# Altium project PCB_Project1.PrjPcb
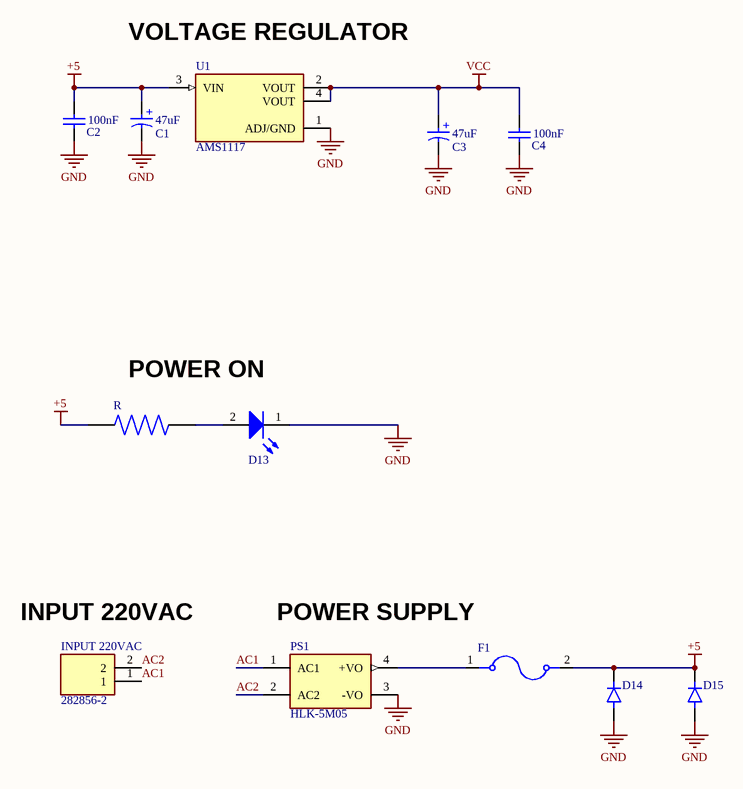
[diagram p0: input.SchDoc]
3 sheets, 71 parts. Net scope: global (net labels, ports and power ports of the same name join across sheets).
Board file: PCB1.PcbDoc
Sheets:
  input.SchDoc
  output.SchDoc
  control.SchDoc

## Sheet input.SchDoc
size A; SheetNumber: 1; SheetTotal: 3

### Parts
C1  47uF  [WCAP-ASLI_D6.3H7.7]
C2  100nF  [WCAP-CSGP_0603_L1.6W0.8H0.8_Wave]
C3  47uF  [WCAP-ASLI_D6.3H7.7]
C4  100nF  [WCAP-CSGP_0603_L1.6W0.8H0.8_Wave]
D13  Infrared, 1.4V, 140°  [WL-SICW_0805_L2W1.3H0.8]  (value not drawn)
D14  S1G  [DIO_S1G]  (value not drawn)
D15  S1G  [DIO_S1G]  (value not drawn)
F1  0154004.DR  [FUSE_0154004.DR]  (value not drawn)
INPUT_220VAC  282856-2  [TE_282856-2]
PS1  HLK-5M05  [CONV_HLK-5M05]
R  FCR1206J10R  [RESC3216X70N]  (value not drawn)
U1  AMS1117  [SOT229P700X180-4N]

### Nets
+5: C1.1(P) C2.2 D14.1(K) D15.1(K) F1.2 R.1 U1.3(VIN)
GND: C1.2(N) C2.1 C3.2(N) C4.1 D13.1(K) D14.2(A) D15.2(A) PS1.3(-VO) U1.1(ADJ/GND)
VCC: C3.1(P) C4.2 U1.2(VOUT) U1.4(VOUT)
AC1: INPUT_220VAC.1 PS1.1(AC1)
AC2: INPUT_220VAC.2 PS1.2(AC2)
NetD13_2: D13.2(A) R.2
NetF1_1: F1.1 PS1.4(+VO)

### Notes on the sheet
- (near U1) VOLTAGE REGULATOR
- POWER ON
- (near INPUT_220VAC) INPUT 220VAC
- (near PS1) POWER SUPPLY
- (in symbol 865080443007) +

### Library data of the parts
C1 C3 = 865080443007: WCAP-ASLI Aluminum Electrolytic Capacitor, V-Chip, D6.3 x H5.5mm, 47uF, 25V; Manufacturer: Wurth Elektronik; Capacitance Tolerance: +/-20%; Dissipation Factor: 14%; Endurance: 2000h; Leakage Current: 11.75uA; Ripple Current: 220mA; Technical Reference: ASED055470M025DVCTBB000; Manufacturer Part Number: 865080443007; Category: Aluminum Electrolytic Capacitors; Match Code: WCAP-ASLI; ComponentLink1Description: Website Link; ComponentLink1URL: https://www.we-online.com/redexpert/article/865080443007?ad; ComponentLink2Description: Datasheet Link; ComponentLink2URL: https://www.we-online.com/redexpert/spec/865080443007?ad; Mount: Surface Mount; Operating Temperature Max: 105°C; Operating Temperature Min: -55°C; Packaging: Tape and Reel; Height: 5.5mm; Diameter: 6.3mm; Capacitance: 47uF; Rated Voltage (DC): 25V
C2 C4 = 885012206071: WCAP-CSGP Multilayer Ceramic Chip Capacitor, General Purpose, size 0603, X7R, 100nF, 25VDC; Manufacturer: Wurth Elektronik; Case/Size Code: 0603; Capacitance Tolerance: +/-10%; Dissipation Factor: 3.5%; Insulation Resistance: 5GΩ; Rated Voltage (DC): 25V; Technical Reference: X7R0603104K025DFCT10000; Manufacturer Part Number: 885012206071; Category: Multilayer Ceramic Chip Capacitors; Match Code: WCAP-CSGP; ComponentLink1Description: Website Link; ComponentLink1URL: https://www.we-online.com/redexpert/article/885012206071?ad; ComponentLink2Description: Datasheet Link; ComponentLink2URL: https://www.we-online.com/redexpert/spec/885012206071?ad; Mount: Surface Mount; Operating Temperature Max: 125°C; Operating Temperature Min: -55°C; Packaging: Tape and Reel; Length: 1.6mm; Width: 0.8mm; Height: 0.8mm; Capacitance: 100nF; Ceramic Type: X7R
D13 = 15412085BA400: WL-SICW SMT Chip LED Infrared Waterclear, size 1206, Infrared, 1.4V, 140°; Manufacturer: Wurth Elektronik; Case/Size Code: 1206; Centroid Wavelength: 850nm; Chip Technology: AlGaAs; Forward Voltage Max: 2V; Radiant Intensity: 2.5mW/sr; Radiant Intensity Min: 1mW/sr; Manufacturer Part Number: 15412085BA400; Category: Infrared LEDs; Match Code: WL-SICW; ComponentLink1Description: Website Link; ComponentLink1URL: https://www.we-online.com/redexpert/article/15412085BA400?ad; ComponentLink2Description: Datasheet Link; ComponentLink2URL: https://www.we-online.com/redexpert/spec/15412085BA400?ad; Mount: Surface Mount; Operating Temperature Max: 85°C; Operating Temperature Min: -40°C; Packaging: Tape and Reel; Length: 3.2mm; Width: 1.6mm; Height: 1.1mm; Emitting Color: Infrared; Forward Voltage: 1.4V; Peak Wavelength: 850nm; Viewing Angle: 140°
D14 D15 = S1G: Diode Standard 400 V 1A Surface Mount DO-214AC (SMA); MF: ON Semiconductor; SnapEDA_Link: https://www.snapeda.com/parts/S1G/Onsemi/view-part/?ref=snap; Value: *; MP: S1G; Availability: In Stock; Purchase-URL: https://pricing.snapeda.com/search/part/S1G/?ref=eda; Check_prices: https://www.snapeda.com/parts/S1G/Onsemi/view-part/?ref=eda; Package: SMA Taiwan Semiconductor; Price: None
F1 = 0154004.DR: 154/154T/154L/154TL Series OMNI-BLOKÂ® Fuse and Holder Assembly; Package: None; Availability: Unavailable; Value: *; MP: 0154004.DR; Price: None
INPUT_220VAC = 282856-2: TERMI-BLOK PCB MOUNT 2P; MF: TE Connectivity; Purchase-URL: https://pricing.snapeda.com/search/part/282856-2/?ref=eda; Package: None; MP: 282856-2; EU_RoHS_Compliance: Compliant with Exemptions; Price: None; Availability: In Stock; Value: *; Check_prices: https://www.snapeda.com/parts/282856-2/TE+Connectivity+AMP+Connectors/view-part/?ref=eda; SnapEDA_Link: https://www.snapeda.com/parts/282856-2/TE+Connectivity+AMP+Connectors/view-part/?ref=snap
PS1 = HLK-5M05: AC DC 220V to 5V 5W 5Watt Isolated Switching Step-Down Power Supply Module Converter; MF: Hi-link; Check_prices: https://www.snapeda.com/parts/HLK-5M05/Hi-link/view-part/?ref=eda; SnapEDA_Link: https://www.snapeda.com/parts/HLK-5M05/Hi-link/view-part/?ref=snap; Price: None; Availability: Not in stock; Package: Package; MP: HLK-5M05; Value: *
R = FCR1206J10R: Res 1206 10 Ohm 5% 1/8W Â±500ppm/Â°C Molded SMD SMD T/R; Resistance: 10; Power_Rating: .125 W; MF: TE Connectivity; DigiKey-Purchase-URL: https://snapeda.com/shop?store=DigiKey&id=988597; Package: 1206; EU_RoHS_Compliance: Compliant with Exemptions; Tolerance: 5%; Value: *; MP: FCR1206J10R; Price: None; SnapEDA_Link: https://www.snapeda.com/parts/FCR1206J10R/TE%20Connectivity%20Passive%20Product/view-part/988597/?ref=snap; Mouser-Purchase-URL: https://snapeda.com/shop?store=Mouser&id=988597; Availability: Warning
U1 = AMS1117: 1A LOW DROPOUT VOLTAGE REGULATOR SOT-223; MF: Advanced Monolithic Systems; Price: None; Availability: Not in stock; Package: SOT-223 Seeed Technology; MP: AMS1117; Value: *; SnapEDA_Link: https://www.snapeda.com/parts/AMS1117/Advanced+Monolithic+Systems/view-part/?ref=snap; Check_prices: https://www.snapeda.com/parts/AMS1117/Advanced+Monolithic+Systems/view-part/?ref=eda

## Sheet output.SchDoc
size A; SheetNumber: 2; SheetTotal: 3
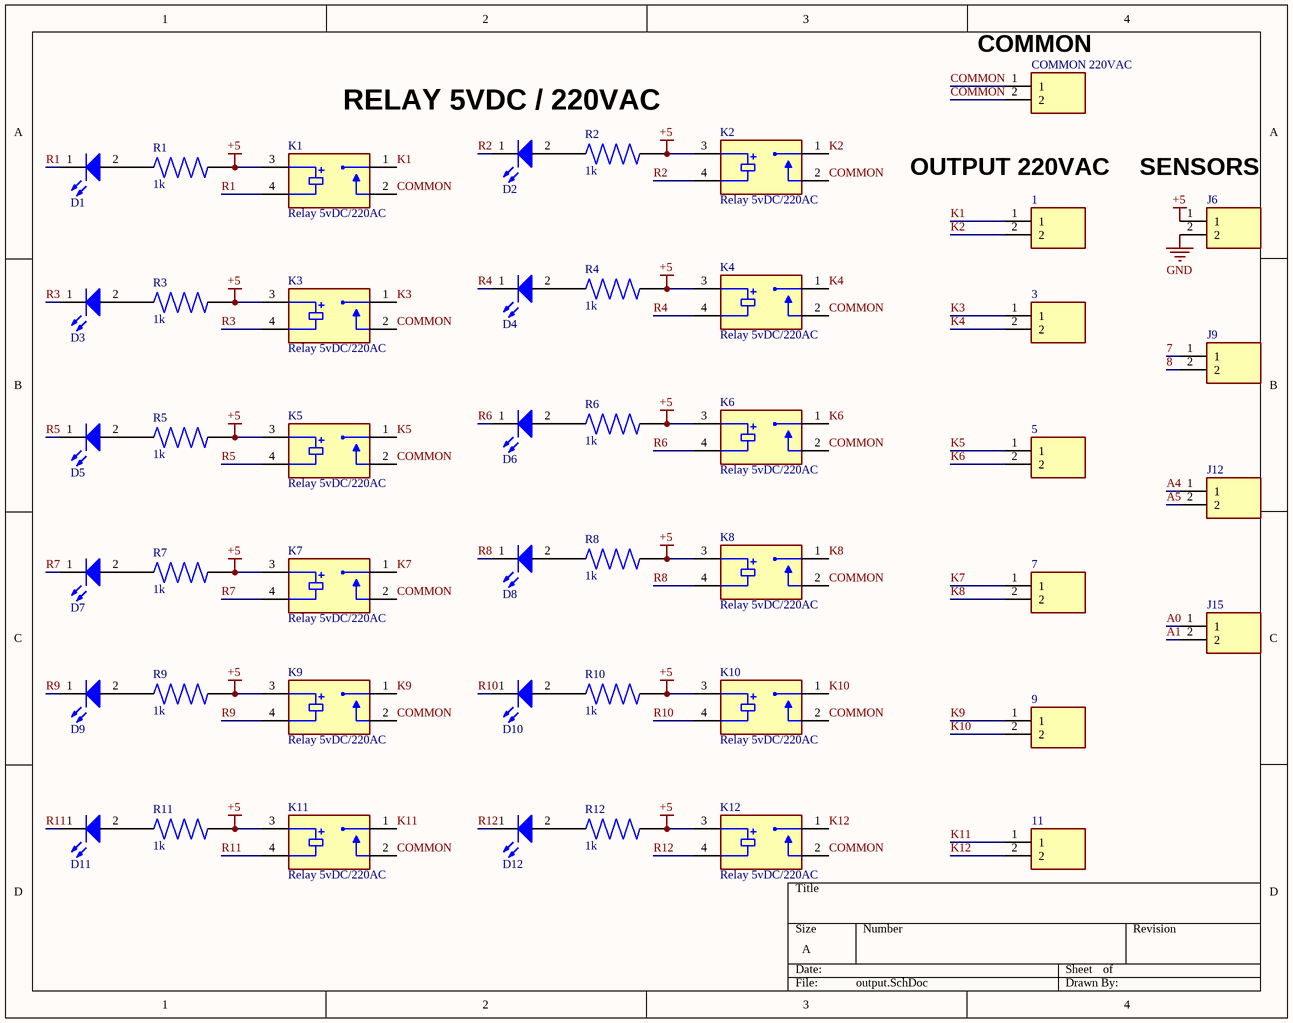
[diagram p1: output.SchDoc]

### Parts
1  282856-2  [TE_282856-2]  (value not drawn)
3  282856-2  [TE_282856-2]  (value not drawn)
5  282856-2  [TE_282856-2]  (value not drawn)
7  282856-2  [TE_282856-2]  (value not drawn)
9  282856-2  [TE_282856-2]  (value not drawn)
11  282856-2  [TE_282856-2]  (value not drawn)
COMMON_220VAC  282856-2  [TE_282856-2]  (value not drawn)
D1  Infrared, 1.4V, 140°  [WL-SICW_0805_L2W1.3H0.8]  (value not drawn)
D2  Infrared, 1.4V, 140°  [WL-SICW_0805_L2W1.3H0.8]  (value not drawn)
D3  Infrared, 1.4V, 140°  [WL-SICW_0805_L2W1.3H0.8]  (value not drawn)
D4  Infrared, 1.4V, 140°  [WL-SICW_0805_L2W1.3H0.8]  (value not drawn)
D5  Infrared, 1.4V, 140°  [WL-SICW_0805_L2W1.3H0.8]  (value not drawn)
D6  Infrared, 1.4V, 140°  [WL-SICW_0805_L2W1.3H0.8]  (value not drawn)
D7  Infrared, 1.4V, 140°  [WL-SICW_0805_L2W1.3H0.8]  (value not drawn)
D8  Infrared, 1.4V, 140°  [WL-SICW_0805_L2W1.3H0.8]  (value not drawn)
D9  Infrared, 1.4V, 140°  [WL-SICW_0805_L2W1.3H0.8]  (value not drawn)
D10  Infrared, 1.4V, 140°  [WL-SICW_0805_L2W1.3H0.8]  (value not drawn)
D11  Infrared, 1.4V, 140°  [WL-SICW_0805_L2W1.3H0.8]  (value not drawn)
D12  Infrared, 1.4V, 140°  [WL-SICW_0805_L2W1.3H0.8]  (value not drawn)
J6  282856-2  [TE_282856-2]  (value not drawn)
J9  282856-2  [TE_282856-2]  (value not drawn)
J12  282856-2  [TE_282856-2]  (value not drawn)
J15  282856-2  [TE_282856-2]  (value not drawn)
K1  Relay 5vDC/220AC  [RELAY_G3MB-202PDC5]
K2  Relay 5vDC/220AC  [RELAY_G3MB-202PDC5]
K3  Relay 5vDC/220AC  [RELAY_G3MB-202PDC5]
K4  Relay 5vDC/220AC  [RELAY_G3MB-202PDC5]
K5  Relay 5vDC/220AC  [RELAY_G3MB-202PDC5]
K6  Relay 5vDC/220AC  [RELAY_G3MB-202PDC5]
K7  Relay 5vDC/220AC  [RELAY_G3MB-202PDC5]
K8  Relay 5vDC/220AC  [RELAY_G3MB-202PDC5]
K9  Relay 5vDC/220AC  [RELAY_G3MB-202PDC5]
K10  Relay 5vDC/220AC  [RELAY_G3MB-202PDC5]
K11  Relay 5vDC/220AC  [RELAY_G3MB-202PDC5]
K12  Relay 5vDC/220AC  [RELAY_G3MB-202PDC5]
R1  1k  [RESC3216X70N]
R2  1k  [RESC3216X70N]
R3  1k  [RESC3216X70N]
R4  1k  [RESC3216X70N]
R5  1k  [RESC3216X70N]
R6  1k  [RESC3216X70N]
R7  1k  [RESC3216X70N]
R8  1k  [RESC3216X70N]
R9  1k  [RESC3216X70N]
R10  1k  [RESC3216X70N]
R11  1k  [RESC3216X70N]
R12  1k  [RESC3216X70N]

### Nets
+5: J6.1 K1.3 K2.3 K3.3 K4.3 K5.3 K6.3 K7.3 K8.3 K9.3 K10.3 K11.3 K12.3 R1.2 R2.2 R3.2 R4.2 R5.2 R6.2 R7.2 R8.2 R9.2 R10.2 R11.2 R12.2
GND: J6.2
7: J9.1
8: J9.2
A0: J15.1
A1: J15.2
A4: J12.1
A5: J12.2
COMMON: COMMON_220VAC.1 COMMON_220VAC.2 K1.2 K2.2 K3.2 K4.2 K5.2 K6.2 K7.2 K8.2 K9.2 K10.2 K11.2 K12.2
K1: 1.1 K1.1
K2: 1.2 K2.1
K3: 3.1 K3.1
K4: 3.2 K4.1
K5: 5.1 K5.1
K6: 5.2 K6.1
K7: 7.1 K7.1
K8: 7.2 K8.1
K9: 9.1 K9.1
K10: 9.2 K10.1
K11: 11.1 K11.1
K12: 11.2 K12.1
R1: D1.1(K) K1.4
R2: D2.1(K) K2.4
R3: D3.1(K) K3.4
R4: D4.1(K) K4.4
R5: D5.1(K) K5.4
R6: D6.1(K) K6.4
R7: D7.1(K) K7.4
R8: D8.1(K) K8.4
R9: D9.1(K) K9.4
R10: D10.1(K) K10.4
R11: D11.1(K) K11.4
R12: D12.1(K) K12.4
NetD1_2: D1.2(A) R1.1
NetD2_2: D2.2(A) R2.1
NetD3_2: D3.2(A) R3.1
NetD4_2: D4.2(A) R4.1
NetD5_2: D5.2(A) R5.1
NetD6_2: D6.2(A) R6.1
NetD7_2: D7.2(A) R7.1
NetD8_2: D8.2(A) R8.1
NetD9_2: D9.2(A) R9.1
NetD10_2: D10.2(A) R10.1
NetD11_2: D11.2(A) R11.1
NetD12_2: D12.2(A) R12.1

### Notes on the sheet
- RELAY 5VDC / 220VAC
- (near COMMON_220VAC) COMMON
- OUTPUT 220VAC
- (near J6) SENSORS

### Library data of the parts
1 3 5 7 9 11 COMMON_220VAC J6 J9 J12 J15 = 282856-2: as INPUT_220VAC on sheet input; Purchase-URL: https://pricing.snapeda.com/search/part/282856-2/?ref=eda; Package: None; MP: 282856-2; EU_RoHS_Compliance: Compliant with Exemptions; Price: None; Availability: In Stock; Value: *; Check_prices: https://www.snapeda.com/parts/282856-2/TE+Connectivity+AMP+Connectors/view-part/?ref=eda; SnapEDA_Link: https://www.snapeda.com/parts/282856-2/TE+Connectivity+AMP+Connectors/view-part/?ref=snap
D1-D12 = 15412085BA400: as D13 on sheet input; Manufacturer Part Number: 15412085BA400; Category: Infrared LEDs; Match Code: WL-SICW; ComponentLink1Description: Website Link; ComponentLink1URL: https://www.we-online.com/redexpert/article/15412085BA400?ad; ComponentLink2Description: Datasheet Link; ComponentLink2URL: https://www.we-online.com/redexpert/spec/15412085BA400?ad; Mount: Surface Mount; Operating Temperature Max: 85°C; Operating Temperature Min: -40°C; Packaging: Tape and Reel; Length: 3.2mm; Width: 1.6mm; Height: 1.1mm; Emitting Color: Infrared; Forward Voltage: 1.4V; Peak Wavelength: 850nm; Viewing Angle: 140°
K1-K12 = G3MB-202PDC5: Solid State SPST-NO (1 Form A) 4-SIP; MF: Omron Automation; SnapEDA_Link: https://www.snapeda.com/parts/G3MB-202P%20DC5/Omron+Automation+and+Safety/view-part/?ref=snap; Value: *; MP: G3MB-202P DC5; Availability: Not in stock; Check_prices: https://www.snapeda.com/parts/G3MB-202P%20DC5/Omron+Automation+and+Safety/view-part/?ref=eda; Package: None; Price: None
R1-R12 = FCR1206J10R: as R on sheet input; DigiKey-Purchase-URL: https://snapeda.com/shop?store=DigiKey&id=988597; Package: 1206; EU_RoHS_Compliance: Compliant with Exemptions; Tolerance: 5%; Value: *; MP: FCR1206J10R; Price: None; SnapEDA_Link: https://www.snapeda.com/parts/FCR1206J10R/TE%20Connectivity%20Passive%20Product/view-part/988597/?ref=snap; Mouser-Purchase-URL: https://snapeda.com/shop?store=Mouser&id=988597; Availability: Warning

## Sheet control.SchDoc
size A; SheetNumber: 3; SheetTotal: 3
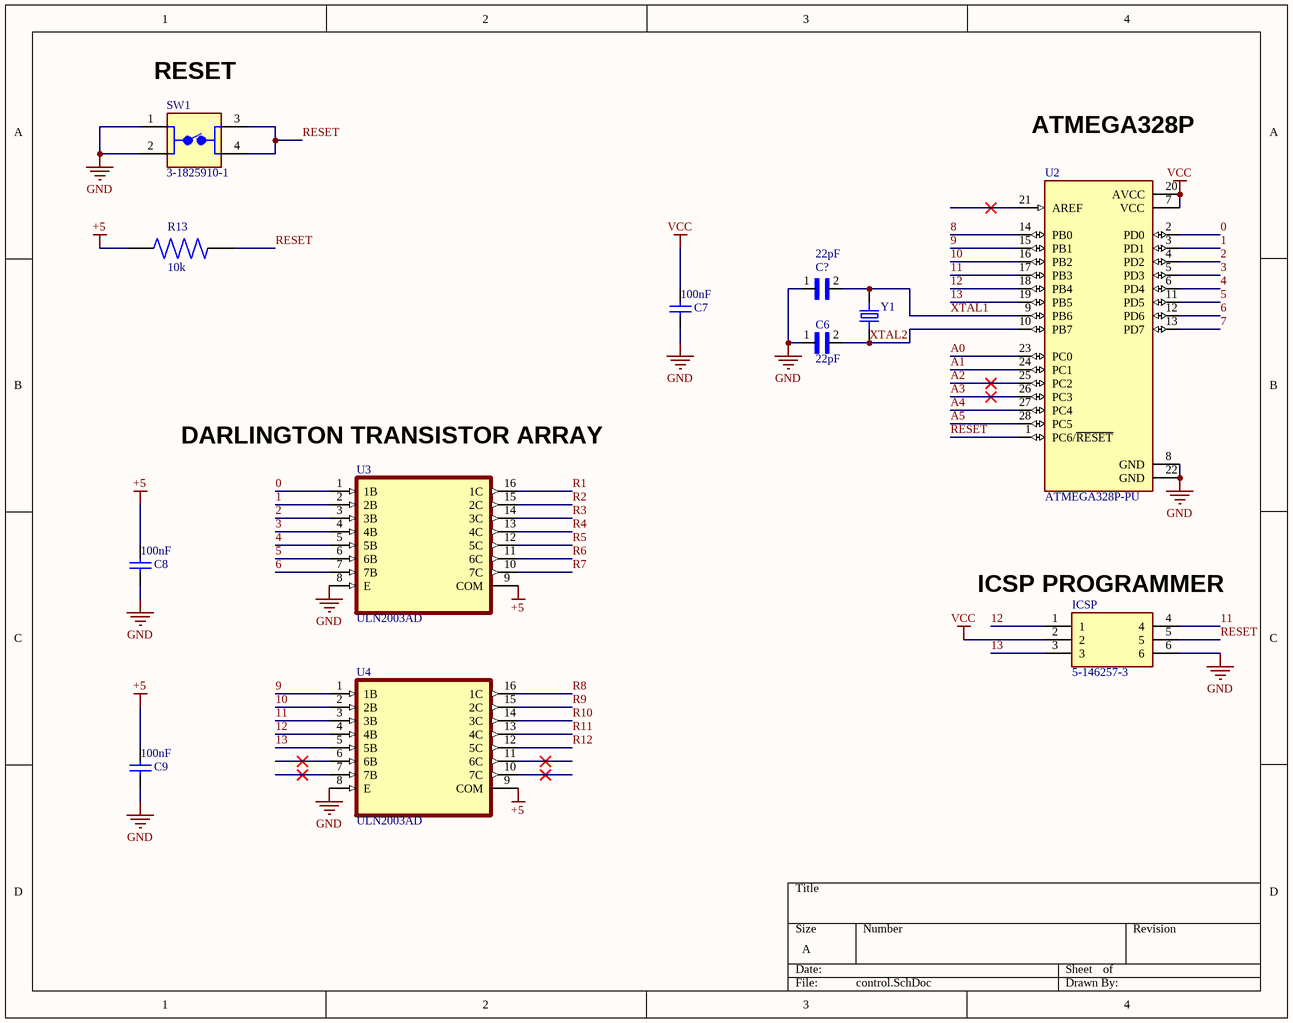
[diagram p2: control.SchDoc]

### Parts
C5  22pF  value C?  [CAPC2012X130N]
C6  22pF  [CAPC2012X130N]
C7  100nF  [WCAP-CSGP_0603_L1.6W0.8H0.8_Wave]
C8  100nF  [WCAP-CSGP_0603_L1.6W0.8H0.8_Wave]
C9  100nF  [WCAP-CSGP_0603_L1.6W0.8H0.8_Wave]
ICSP  5-146257-3  [TE_5-146257-3]
R13  10k  [RESC3216X70N]
SW1  3-1825910-1  [TE_3-1825910-1]
U2  ATMEGA328P-PU  [DIL28]
U3  ULN2003AD  [SOIC127P600X175-16N]
U4  ULN2003AD  [SOIC127P600X175-16N]
Y1  (no value)  [XTAL_ECS-160-20-3X-TR]

### Nets
+5: C8.2 C9.2 R13.1 U3.9(COM) U4.9(COM)
GND: C5.1 C6.1 C7.1 C8.1 C9.1 ICSP.6 SW1.1 SW1.2 U2.8(GND) U2.22(GND) U3.8(E) U4.8(E)
VCC: C7.2 ICSP.2 U2.7(VCC) U2.20(AVCC)
0: U2.2(PD0) U3.1(1B)
1: U2.3(PD1) U3.2(2B)
2: U2.4(PD2) U3.3(3B)
3: U2.5(PD3) U3.4(4B)
4: U2.6(PD4) U3.5(5B)
5: U2.11(PD5) U3.6(6B)
6: U2.12(PD6) U3.7(7B)
7: U2.13(PD7)
8: U2.14(PB0)
9: U2.15(PB1) U4.1(1B)
10: U2.16(PB2) U4.2(2B)
11: ICSP.4 U2.17(PB3) U4.3(3B)
12: ICSP.1 U2.18(PB4) U4.4(4B)
13: ICSP.3 U2.19(PB5) U4.5(5B)
A0: U2.23(PC0)
A1: U2.24(PC1)
A2: U2.25(PC2)
A3: U2.26(PC3)
A4: U2.27(PC4)
A5: U2.28(PC5)
R1: U3.16(1C)
R2: U3.15(2C)
R3: U3.14(3C)
R4: U3.13(4C)
R5: U3.12(5C)
R6: U3.11(6C)
R7: U3.10(7C)
R8: U4.16(1C)
R9: U4.15(2C)
R10: U4.14(3C)
R11: U4.13(4C)
R12: U4.12(5C)
RESET: ICSP.5 R13.2 SW1.3 SW1.4 U2.1(PC6/~{RESET})
XTAL1: C5.2 U2.9(PB6) Y1.2
XTAL2: C6.2 U2.10(PB7) Y1.1

Not connected (* = marked no-connect by the designer): U2 21(AREF)*; U4 6(6B)* 7(7B)* 10(7C)* 11(6C)*

### Notes on the sheet
- (near SW1) RESET
- ATMEGA328P
- (near U3) DARLINGTON TRANSISTOR ARRAY
- (near ICSP) ICSP PROGRAMMER

### Library data of the parts
C5 C6 = 0805Y0500220JCT: Cap Cer 22pf 50v C0g/Np0 0805; MF: Syfer; Mouser-Purchase-URL: https://snapeda.com/shop?store=Mouser&id=1818858; Package: 2012 Knowles Syfer; Price: None; MP: 0805Y0500220JCT; Availability: Warning; SnapEDA_Link: https://www.snapeda.com/parts/0805Y0500220JCT/Syfer/view-part/1818858/?ref=snap; BuyPart: https://www.snapeda.com/parts/0805Y0500220JCT/Syfer/view-part/1818858/?ref=eda
  C6: Value: *
C7-C9 = 885012206071: as C2 on sheet input; Manufacturer Part Number: 885012206071; Category: Multilayer Ceramic Chip Capacitors; Match Code: WCAP-CSGP; ComponentLink1Description: Website Link; ComponentLink1URL: https://www.we-online.com/redexpert/article/885012206071?ad; ComponentLink2Description: Datasheet Link; ComponentLink2URL: https://www.we-online.com/redexpert/spec/885012206071?ad; Mount: Surface Mount; Operating Temperature Max: 125°C; Operating Temperature Min: -55°C; Packaging: Tape and Reel; Length: 1.6mm; Width: 0.8mm; Height: 0.8mm; Capacitance: 100nF; Ceramic Type: X7R
ICSP = 5-146257-3: Header; Breakaway; 0.100 x 0.100 in.; PC Board; Dual; 6; 0.025 in.; 0.12 in.; MF: TE Connectivity; EU_RoHS_Compliance: Compliant; SnapEDA_Link: https://www.snapeda.com/parts/5-146257-3/TE+Connectivity+AMP+Connectors/view-part/?ref=snap; Purchase-URL: https://pricing.snapeda.com/search/part/5-146257-3/?ref=eda; Package: None; MP: 5-146257-3; Price: None; Availability: In Stock; Check_prices: https://www.snapeda.com/parts/5-146257-3/TE+Connectivity+AMP+Connectors/view-part/?ref=eda; Value: *
R13 = FCR1206J10R: as R on sheet input; DigiKey-Purchase-URL: https://snapeda.com/shop?store=DigiKey&id=988597; Package: 1206; EU_RoHS_Compliance: Compliant with Exemptions; Tolerance: 5%; Value: *; MP: FCR1206J10R; Price: None; SnapEDA_Link: https://www.snapeda.com/parts/FCR1206J10R/TE%20Connectivity%20Passive%20Product/view-part/988597/?ref=snap; Mouser-Purchase-URL: https://snapeda.com/shop?store=Mouser&id=988597; Availability: Warning
SW1 = 3-1825910-1: Switch Push Button OFF (ON) SPST Round Button 0.05A 24VDC Momentary Contact PC Pins Thru-Hole; MF: TE Connectivity; Value: *; SnapEDA_Link: https://www.snapeda.com/parts/3-1825910-1/TE+Connectivity+ALCOSWITCH+Switches/view-part/?ref=snap; Purchase-URL: https://pricing.snapeda.com/search/part/3-1825910-1/?ref=eda; Availability: In Stock; Price: None; Package: None; Check_prices: https://www.snapeda.com/parts/3-1825910-1/TE+Connectivity+ALCOSWITCH+Switches/view-part/?ref=eda; MP: 3-1825910-1
U2 = ATMEGA328P-PU: ATmega Series 20 MHz 32 KB Flash 2 KB SRAM 8-Bit Microcontroller - DIP-28; MP: ATMEGA328P-PU; Package: None; Availability: Unavailable; Price: None; Value: *
U3 U4 = ULN2003AD: 50-V, 7-ch darlington transistor array, -20C to 70C; MF: Texas Instruments; Check_prices: https://www.snapeda.com/parts/ULN2003AD/Texas+Instruments/view-part/?ref=eda; SnapEDA_Link: https://www.snapeda.com/parts/ULN2003AD/Texas+Instruments/view-part/?ref=snap; Price: None; Availability: In Stock; Value: *; MP: ULN2003AD; Package: SOIC-16 Texas Instruments; Purchase-URL: https://pricing.snapeda.com/search/part/ULN2003AD/?ref=eda
Y1 = ECS-160-20-3X-TR: 16MHz Â±30ppm Crystal 20pF 50 Ohms HC-49/US; MF: ECS Inc.; Digi-Key_Part_Number: XC1776CT-ND; Digi-Key_Purchase_URL: https://www.digikey.com/product-detail/en/ecs-inc/ECS-160-20-3X-TR/XC1776CT-ND/2676640?utm_source=snapeda&utm_medium=aggregator&utm_campaign=symbol; Package: HC49/US ECS International; MP: ECS-160-20-3X-TR; Value: *; SnapEDA_Link: https://www.snapeda.com/parts/ECS-160-20-3X-TR/ECS%20Inc./view-part/561589/?ref=snap

## Nets that join several sheets
+5: input (7 pins), output (25 pins), control (5 pins)
GND: input (9 pins), output (J6.2), control (12 pins)
VCC: input (C3.1 C4.2 U1.2 U1.4), control (C7.2 ICSP.2 U2.7 U2.20)
7: output (J9.1), control (U2.13)
8: output (J9.2), control (U2.14)
A0: output (J15.1), control (U2.23)
A1: output (J15.2), control (U2.24)
A4: output (J12.1), control (U2.27)
A5: output (J12.2), control (U2.28)
R1: output (D1.1 K1.4), control (U3.16)
R2: output (D2.1 K2.4), control (U3.15)
R3: output (D3.1 K3.4), control (U3.14)
R4: output (D4.1 K4.4), control (U3.13)
R5: output (D5.1 K5.4), control (U3.12)
R6: output (D6.1 K6.4), control (U3.11)
R7: output (D7.1 K7.4), control (U3.10)
R8: output (D8.1 K8.4), control (U4.16)
R9: output (D9.1 K9.4), control (U4.15)
R10: output (D10.1 K10.4), control (U4.14)
R11: output (D11.1 K11.4), control (U4.13)
R12: output (D12.1 K12.4), control (U4.12)